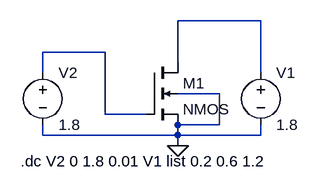
[diagram p0: schematic 2Schematic.asc]
2Schematic.asc, the LTspice schematic file:
Version 4
SHEET 1 880 680
WIRE 384 48 256 48
WIRE 144 96 48 96
WIRE 256 112 256 48
WIRE 48 128 48 96
WIRE 384 128 384 48
WIRE 320 160 256 160
WIRE 144 192 144 96
WIRE 208 192 144 192
WIRE 320 208 320 160
WIRE 320 208 256 208
WIRE 48 224 48 208
WIRE 256 224 256 208
WIRE 256 224 48 224
WIRE 384 224 384 208
WIRE 384 224 256 224
WIRE 256 240 256 224
FLAG 256 240 0
SYMBOL voltage 384 112 R0
WINDOW 123 0 0 Left 0
WINDOW 39 0 0 Left 0
SYMATTR InstName V1
SYMATTR Value 1.8
SYMBOL voltage 48 112 R0
WINDOW 123 0 0 Left 0
WINDOW 39 0 0 Left 0
SYMATTR InstName V2
SYMATTR Value 1.8
SYMBOL nmos4 208 112 R0
SYMATTR InstName M1
SYMATTR Value2 l=0.18u w=0.27u
TEXT 14 264 Left 2 !.dc V2 0 1.8 0.01 V1 list 0.2 0.6 1.2

The netlist it stands for:
* 2Schematic.asc
V1 N001 0 1.8
V2 N002 0 1.8
M1 N001 N002 0 0 NMOS l=0.18u w=0.27u
.model NMOS NMOS
.model PMOS PMOS
.lib standard.mos
.dc V2 0 1.8 0.01 V1 list 0.2 0.6 1.2
.backanno
.end